# Altium schematic sheet APP_1_PLL.SchDoc
size Tabloid; SheetNumber: 6; SheetTotal: 6; Sheet_Name: PLL; Size: 11x17
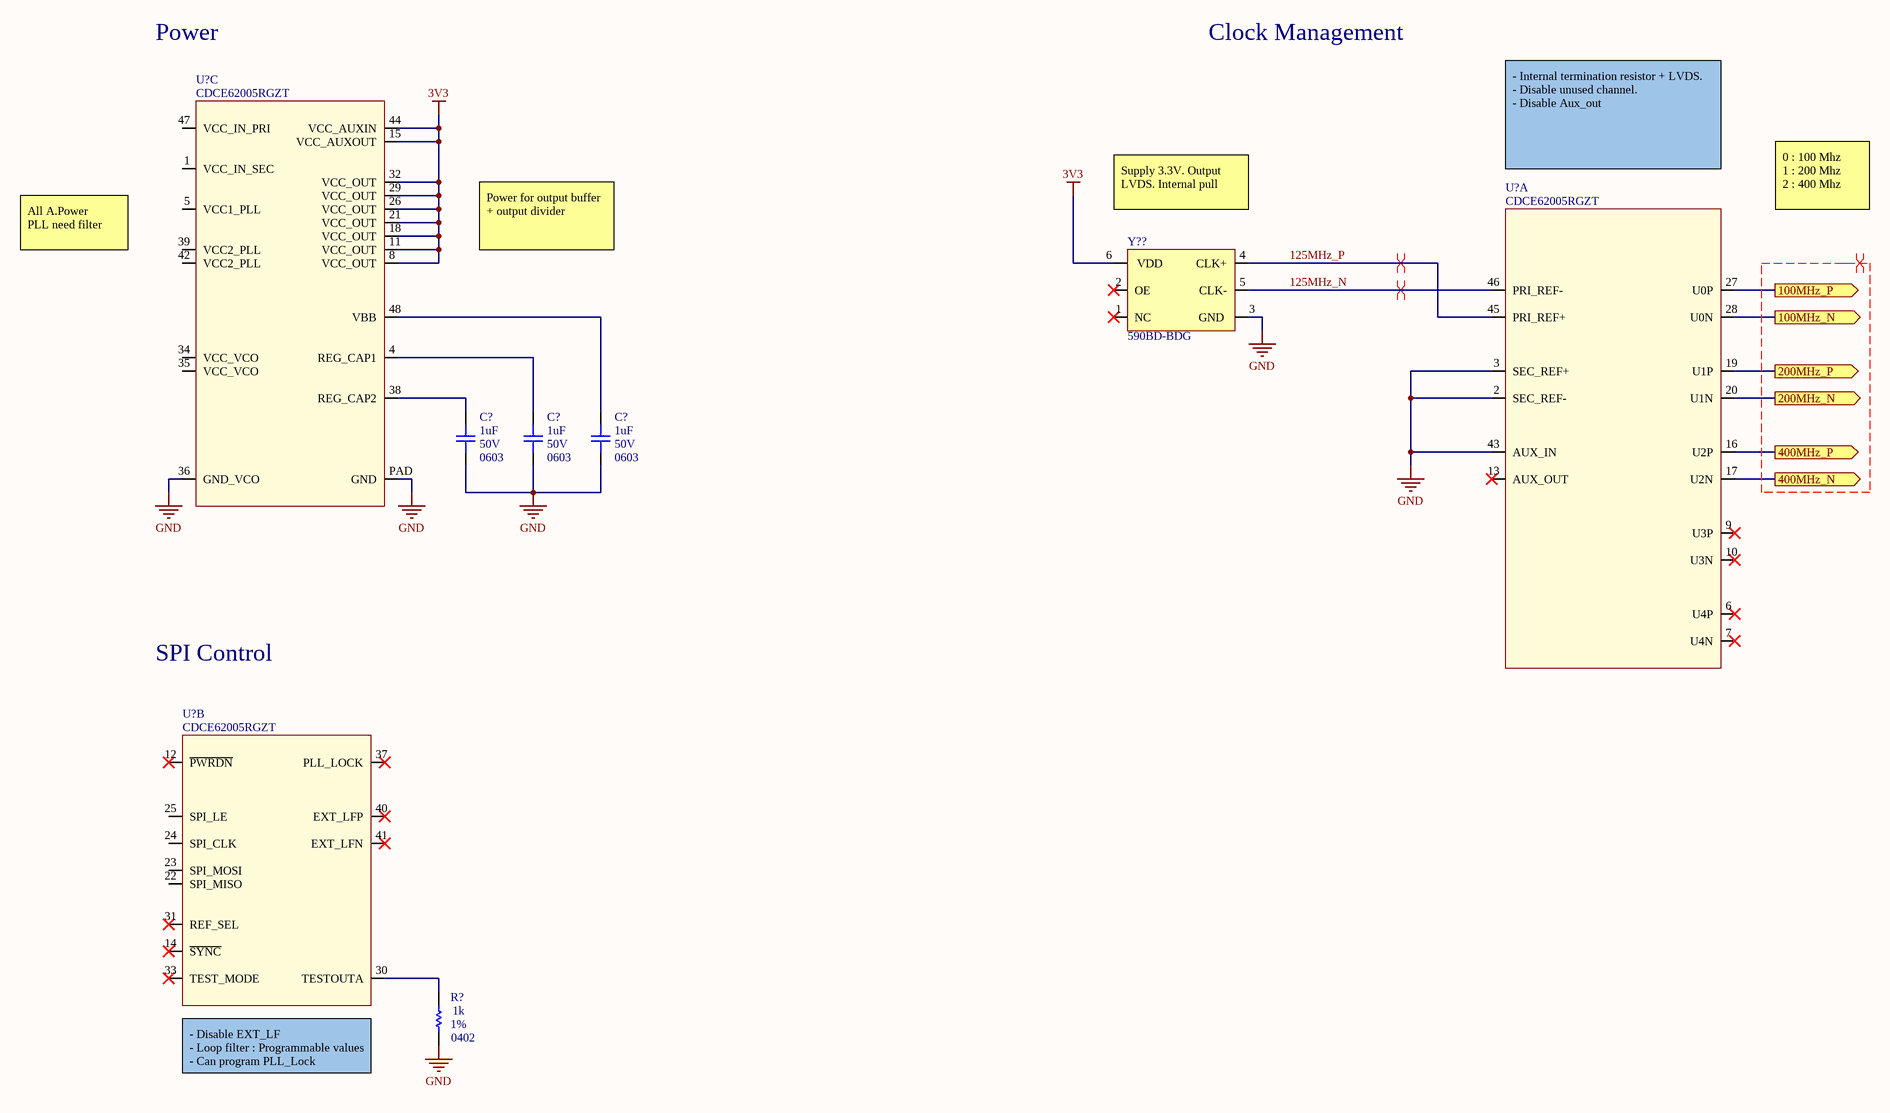
[diagram p0: APP_1_PLL.SchDoc]

## Parts
(Parts that share a designator on the sheet are numbered #1, #2 ... from top to bottom, then left to right.)
C?#1  value 1uF  Voltage: 50V  Package: 0603  [CAP_0603]  (hidden comment: CAP - 0603)
C?#2  value 1uF  Voltage: 50V  Package: 0603  [CAP_0603]  (hidden comment: CAP - 0603)
C?#3  value 1uF  Voltage: 50V  Package: 0603  [CAP_0603]  (hidden comment: CAP - 0603)
R?  value 1k  Package: 0402  Precision: 1%  [RES_0402]  (hidden comment: RES - 0402)
U?#1  CDCE62005RGZT  [TIM_CDCE62005RGZT]  (part C of 3)
U?#2  CDCE62005RGZT  [TIM_CDCE62005RGZT]  (part A of 3)
U?#3  CDCE62005RGZT  [TIM_CDCE62005RGZT]  (part B of 3)
Y??  590BD-BDG  [OSC_590BD-BDG]

## Ports
100MHz_N (out), 100MHz_P (out), 200MHz_N (out), 200MHz_P (out), 400MHz_N (out), 400MHz_P (out)

## Nets
3V3: U?#1.8(VCC_OUT) U?#1.11(VCC_OUT) U?#1.15(VCC_AUXOUT) U?#1.18(VCC_OUT) U?#1.21(VCC_OUT) U?#1.26(VCC_OUT) U?#1.29(VCC_OUT) U?#1.32(VCC_OUT) U?#1.44(VCC_AUXIN) Y??.6(VDD)
GND: C?#1.1 C?#2.1 C?#3.1 R?.1 U?#1.36(GND_VCO) U?#1.PAD(GND) U?#2.2(SEC_REF-) U?#2.3(SEC_REF+) U?#2.43(AUX_IN) Y??.3(GND)
100MHz_N: U?#2.28(U0N) ; port 100MHz_N
100MHz_P: U?#2.27(U0P) ; port 100MHz_P
125MHz_N: U?#2.46(PRI_REF-) Y??.5(CLK-)
125MHz_P: U?#2.45(PRI_REF+) Y??.4(CLK+)
200MHz_N: U?#2.20(U1N) ; port 200MHz_N
200MHz_P: U?#2.19(U1P) ; port 200MHz_P
400MHz_N: U?#2.17(U2N) ; port 400MHz_N
400MHz_P: U?#2.16(U2P) ; port 400MHz_P
NetC?#1_2: C?#1.2 U?#1.38(REG_CAP2)
NetC?#2_2: C?#2.2 U?#1.4(REG_CAP1)
NetC?#3_2: C?#3.2 U?#1.48(VBB)
NetR?_2: R?.2 U?#3.30(TESTOUTA)

Not connected (* = marked no-connect by the designer): U?#1 1(VCC_IN_SEC) 5(VCC1_PLL) 34(VCC_VCO) 35(VCC_VCO) 39(VCC2_PLL) 42(VCC2_PLL) 47(VCC_IN_PRI); U?#2 6(U4P)* 7(U4N)* 9(U3P)* 10(U3N)* 13(AUX_OUT)*; U?#3 12(~{PWRDN})* 14(~{SYNC})* 22(SPI_MISO) 23(SPI_MOSI) 24(SPI_CLK) 25(SPI_LE) 31(REF_SEL)* 33(TEST_MODE)* 37(PLL_LOCK)* 40(EXT_LFP)* 41(EXT_LFN)*; Y?? 1(NC)* 2(OE)*

## Layout directives
differential pair: 125MHz_N, 125MHz_P, (no net found under the mark)

## Notes on the sheet
- Power
- Clock Management
- - Internal termination resistor + LVDS.
  - Disable unused channel.
  - Disable Aux_out
- All A.Power
  PLL need filter
- Power for output buffer + output divider
- Supply 3.3V. Output LVDS. Internal pull
- 0 : 100 Mhz
  1 : 200 Mhz
  2 : 400 Mhz
- SPI Control
- (near U?#3) - Disable EXT_LF
  - Loop filter : Programmable values
  - Can program PLL_Lock
- Sheet Name
- Project Title
- Global Project
- Size
- Group
- Revision
- Date
- Sheet
- of
- Filename
- Designers

## Library data of the parts
C?#1-C?#3 = CAP - 0603: Precision: 10%; Current: *; CreatedBy: Jonathan Bouchard; Power: *
R? = RES - 0402: Voltage: 50V; Power: 1/16W; Current: *; CreatedBy: Jonathan Bouchard
U?#1-U?#3 = TIM_CDCE62005RGZT: TIM - CLK SYNTH JITTER CLEANER 3:5 - QFN-48; Voltage: 3 V ~ 3.6 V; Mfg: Texas Instruments; Current: *; Power: *; Mfg Part Number: CDCE62005RGZT; HelpURL: http://www.ti.com/lit/ds/symlink/cdce62005.pdf; CreatedBy: Jonathan Bouchard; Temperature: -40°C ~ 85°C; Value: *; Precision: *; Package: QFN-48; Supplier 1: Digikey; Supplier Part Number 1: 296-23947-1-ND
Y?? = OSC_590BD-BDG: TIM - OSC PROG 125MHz ~ 214.999MHz LVDS 3.3V 7PPM EN/DS - 6-SMD; Manufacturer #1: Silicon Labs; Current Rating: 100 mA (supply); Note: Spécifié la fréquence lors de la commande; Voltage rating: 3.3V (supply); Polarized: Yes; Value: ±7ppm (freq Stability), ±20ppm (freq stability total); Magnetic Material: UNKNOWN; GRAMS Lib Spec: 2.8; Manufacturer #2: *; Power Max: *; Part Number #1: 590BD-BDG; Part Number #2: *; HelpURL: https://www.silabs.com/documents/public/data-sheets/Si590-591.pdf; Supplier 1: Digi-Key; Supplier Part Number 1: 590BD-BDG-ND; Assembly Type: SMD; Temperature: -40°C ~ 85°C; Package: 6-SMD; CreatedBy/Date: from 590BD-CDG; Tolerance: *; VerifiedBy: Caroline Paulin / 3/10/2019; Cryo: UNKNOWN